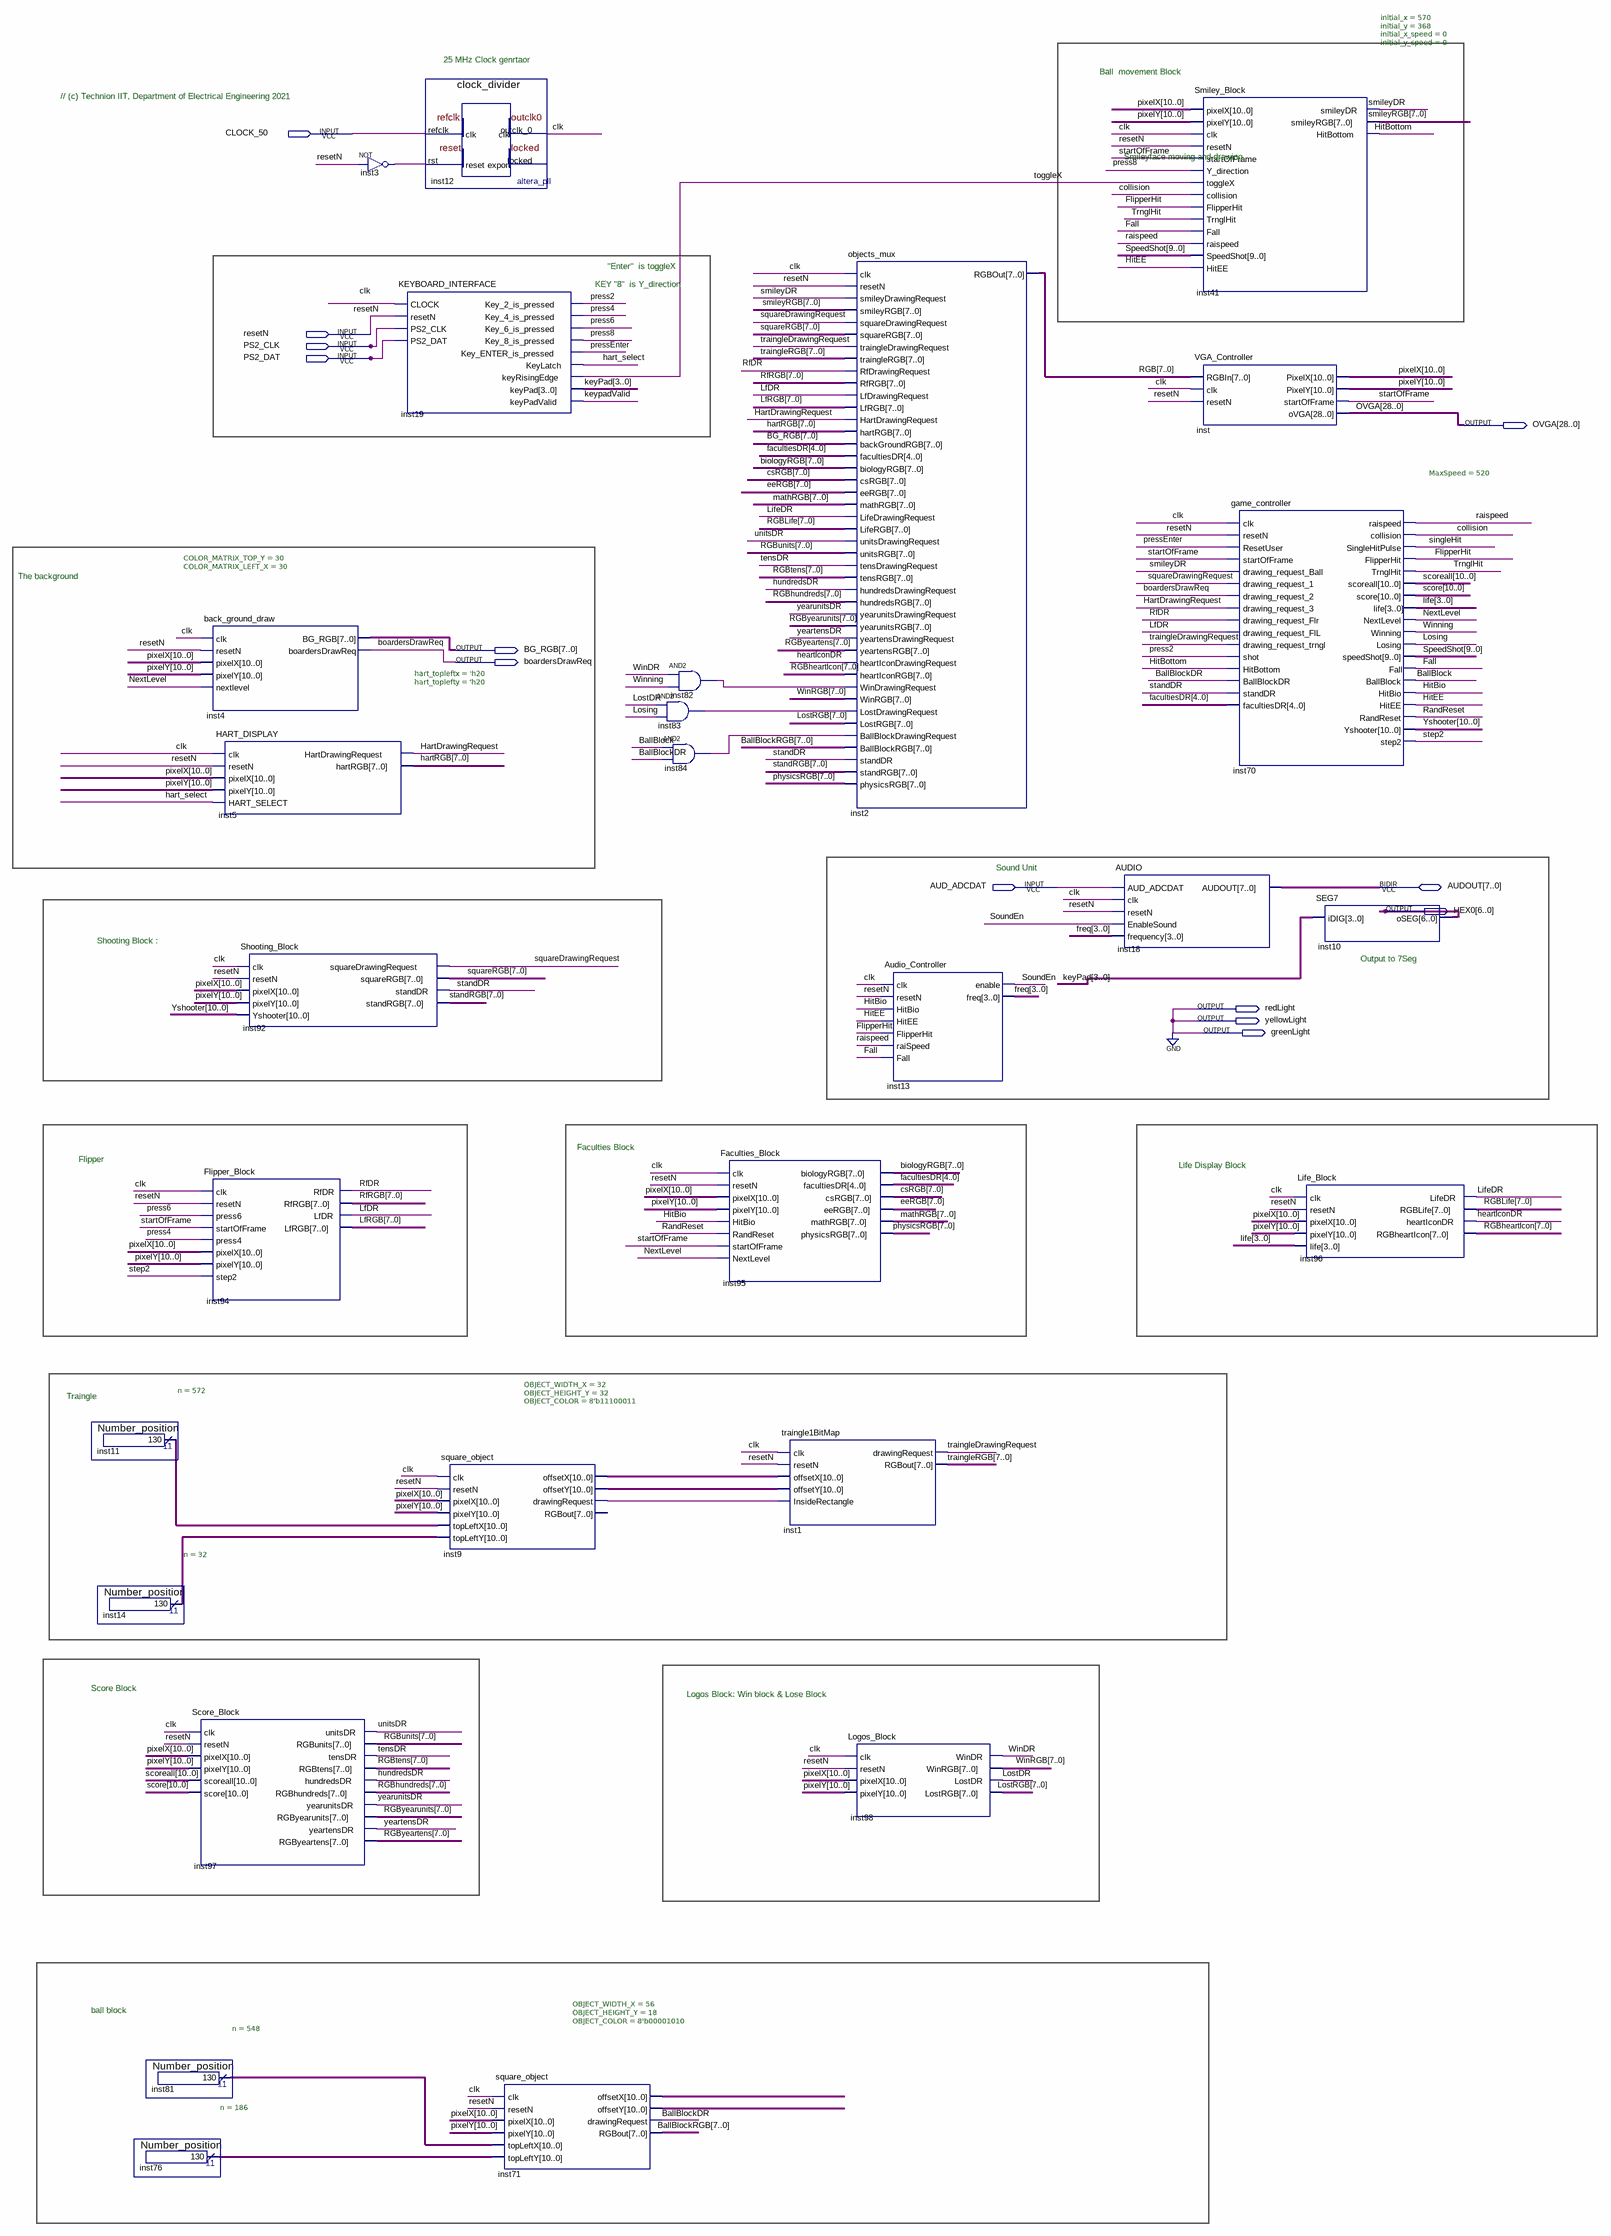
[diagram p0: schematic sheet]
// Quartus schematic Project_Top.bdf as structural Verilog: 28 symbols, 13 pins
module Project_Top (
  input  CLOCK_50,
  input  resetN,
  input  PS2_CLK,
  input  PS2_DAT,
  input  AUD_ADCDAT,
  inout  [7:0] AUDOUT,
  output [28:0] OVGA,
  output [7:0] BG_RGB,
  output boardersDrawReq,
  output [6:0] HEX0,
  output redLight,
  output yellowLight,
  output greenLight
);

  wire BallBlock, BallBlockDR, clk, collision, Fall, FlipperHit, hart_select, HartDrawingRequest,
       heartIconDR, HitBio, HitBottom, HitEE, hundredsDR, inst3_out, inst9_drawingrequest, inst82_out,
       inst83_out, inst84_out, keypadValid, LfDR, LifeDR, Losing, LostDR, NextLevel, press2, press4, press6,
       press8, pressEnter, raispeed, RandReset, RfDR, singleHit, smileyDR, SoundEn, squareDrawingRequest,
       standDR, startOfFrame, step2, tensDR, toggleX, traingleDrawingRequest, TrnglHit, unitsDR, WinDR,
       Winning, yeartensDR, yearunitsDR;
  wire [3:0] freq, keyPad, life;
  wire [4:0] facultiesDR;
  wire [7:0] BallBlockRGB, biologyRGB, csRGB, eeRGB, hartRGB, LfRGB, LostRGB, mathRGB, physicsRGB, RfRGB,
       RGB, RGBheartIcon, RGBhundreds, RGBLife, RGBtens, RGBunits, RGByeartens, RGByearunits, smileyRGB,
       squareRGB, standRGB, traingleRGB, WinRGB;
  wire [9:0] SpeedShot;
  wire [10:0] inst9_offsetx, inst9_offsety, inst11_result, inst14_result, inst71_offsetx, inst71_offsety,
       inst76_result, inst81_result, pixelX, pixelY, score, scoreall, Yshooter;

  Number_position #(.n(572)) inst11 (.result(inst11_result));
  Number_position #(.n(32)) inst14 (.result(inst14_result));
  Number_position #(.n(548)) inst81 (.result(inst81_result));
  Number_position #(.n(186)) inst76 (.result(inst76_result));
  Score_Block inst97 (
    .clk(clk), .resetN(resetN), .pixelX(pixelX), .pixelY(pixelY), .scoreall(scoreall), .score(score),
    .unitsDR(unitsDR), .RGBunits(RGBunits), .tensDR(tensDR), .RGBtens(RGBtens), .hundredsDR(hundredsDR),
    .RGBhundreds(RGBhundreds), .yearunitsDR(yearunitsDR), .RGByearunits(RGByearunits),
    .yeartensDR(yeartensDR), .RGByeartens(RGByeartens));
  back_ground_draw #(.COLOR_MATRIX_TOP_Y(30), .COLOR_MATRIX_LEFT_X(30)) inst4 (
    .clk(clk), .resetN(resetN), .pixelX(pixelX), .pixelY(pixelY), .nextlevel(NextLevel), .BG_RGB(BG_RGB),
    .boardersDrawReq(boardersDrawReq));
  HART_DISPLAY #(.hart_topleftx('h20), .hart_toplefty('h20)) inst5 (
    .clk(clk), .resetN(resetN), .pixelX(pixelX), .pixelY(pixelY), .HART_SELECT(hart_select),
    .HartDrawingRequest(HartDrawingRequest), .hartRGB(hartRGB));
  Shooting_Block inst92 (
    .clk(clk), .resetN(resetN), .pixelX(pixelX), .pixelY(pixelY), .Yshooter(Yshooter),
    .squareDrawingRequest(squareDrawingRequest), .squareRGB(squareRGB), .standDR(standDR), .standRGB(standRGB));
  Flipper_Block inst94 (
    .clk(clk), .resetN(resetN), .press6(press6), .startOfFrame(startOfFrame), .press4(press4),
    .pixelX(pixelX), .pixelY(pixelY), .step2(step2), .RfDR(RfDR), .RfRGB(RfRGB), .LfDR(LfDR), .LfRGB(LfRGB));
  not inst3 (inst3_out, resetN);
  clock_divider inst12 (.refclk(CLOCK_50), .rst(inst3_out), .outclk_0(clk));  // open: locked
  KEYBOARD_INTERFACE inst19 (
    .CLOCK(clk), .resetN(resetN), .PS2_CLK(PS2_CLK), .PS2_DAT(PS2_DAT), .Key_2_is_pressed(press2),
    .Key_4_is_pressed(press4), .Key_6_is_pressed(press6), .Key_8_is_pressed(press8),
    .Key_ENTER_is_pressed(pressEnter), .KeyLatch(hart_select), .keyRisingEdge(toggleX), .keyPad(keyPad),
    .keyPadValid(keypadValid));
  square_object #(.OBJECT_WIDTH_X(32), .OBJECT_HEIGHT_Y(32), .OBJECT_COLOR(8'b11100011)) inst9 (
    .clk(clk), .resetN(resetN), .pixelX(pixelX), .pixelY(pixelY), .topLeftX(inst11_result),
    .topLeftY(inst14_result), .offsetX(inst9_offsetx), .offsetY(inst9_offsety),
    .drawingRequest(inst9_drawingrequest));  // open: RGBout
  square_object #(.OBJECT_WIDTH_X(56), .OBJECT_HEIGHT_Y(18), .OBJECT_COLOR(8'b00001010)) inst71 (
    .clk(clk), .resetN(resetN), .pixelX(pixelX), .pixelY(pixelY), .topLeftX(inst81_result),
    .topLeftY(inst76_result), .offsetX(inst71_offsetx), .offsetY(inst71_offsety),
    .drawingRequest(BallBlockDR), .RGBout(BallBlockRGB));
  and inst82 (inst82_out, WinDR, Winning);
  and inst83 (inst83_out, LostDR, Losing);
  and inst84 (inst84_out, BallBlock, BallBlockDR);
  Faculties_Block inst95 (
    .clk(clk), .resetN(resetN), .pixelX(pixelX), .pixelY(pixelY), .HitBio(HitBio), .RandReset(RandReset),
    .startOfFrame(startOfFrame), .NextLevel(NextLevel), .biologyRGB(biologyRGB), .facultiesDR(facultiesDR),
    .csRGB(csRGB), .eeRGB(eeRGB), .mathRGB(mathRGB), .physicsRGB(physicsRGB));
  traingle1BitMap inst1 (
    .clk(clk), .resetN(resetN), .offsetX(inst9_offsetx), .offsetY(inst9_offsety),
    .InsideRectangle(inst9_drawingrequest), .drawingRequest(traingleDrawingRequest), .RGBout(traingleRGB));
  objects_mux inst2 (
    .clk(clk), .resetN(resetN), .smileyDrawingRequest(smileyDR), .smileyRGB(smileyRGB),
    .squareDrawingRequest(squareDrawingRequest), .squareRGB(squareRGB),
    .traingleDrawingRequest(traingleDrawingRequest), .traingleRGB(traingleRGB), .RfDrawingRequest(RfDR),
    .RfRGB(RfRGB), .LfDrawingRequest(LfDR), .LfRGB(LfRGB), .HartDrawingRequest(HartDrawingRequest),
    .hartRGB(hartRGB), .backGroundRGB(BG_RGB), .facultiesDR(facultiesDR), .biologyRGB(biologyRGB),
    .csRGB(csRGB), .eeRGB(eeRGB), .mathRGB(mathRGB), .LifeDrawingRequest(LifeDR), .LifeRGB(RGBLife),
    .unitsDrawingRequest(unitsDR), .unitsRGB(RGBunits), .tensDrawingRequest(tensDR), .tensRGB(RGBtens),
    .hundredsDrawingRequest(hundredsDR), .hundredsRGB(RGBhundreds), .yearunitsDrawingRequest(yearunitsDR),
    .yearunitsRGB(RGByearunits), .yeartensDrawingRequest(yeartensDR), .yeartensRGB(RGByeartens),
    .heartIconDrawingRequest(heartIconDR), .heartIconRGB(RGBheartIcon), .WinDrawingRequest(inst82_out),
    .WinRGB(WinRGB), .LostDrawingRequest(inst83_out), .LostRGB(LostRGB),
    .BallBlockDrawingRequest(inst84_out), .BallBlockRGB(BallBlockRGB), .standDR(standDR),
    .standRGB(standRGB), .physicsRGB(physicsRGB), .RGBOut(RGB));
  Logos_Block inst98 (
    .clk(clk), .resetN(resetN), .pixelX(pixelX), .pixelY(pixelY), .WinDR(WinDR), .WinRGB(WinRGB),
    .LostDR(LostDR), .LostRGB(LostRGB));
  Audio_Controller inst13 (
    .clk(clk), .resetN(resetN), .HitBio(HitBio), .HitEE(HitEE), .FlipperHit(FlipperHit), .raiSpeed(raispeed),
    .Fall(Fall), .enable(SoundEn), .freq(freq));
  AUDIO inst18 (
    .AUD_ADCDAT(AUD_ADCDAT), .clk(clk), .resetN(resetN), .EnableSound(SoundEn), .frequency(freq),
    .AUDOUT(AUDOUT));
  Smiley_Block #(.initial_x(570), .initial_y(368), .initial_x_speed(0), .initial_y_speed(0)) inst41 (
    .pixelX(pixelX), .pixelY(pixelY), .clk(clk), .resetN(resetN), .startOfFrame(startOfFrame),
    .Y_direction(press8), .toggleX(toggleX), .collision(collision), .FlipperHit(FlipperHit),
    .TrnglHit(TrnglHit), .Fall(Fall), .raispeed(raispeed), .SpeedShot(SpeedShot), .HitEE(HitEE),
    .smileyDR(smileyDR), .smileyRGB(smileyRGB), .HitBottom(HitBottom));
  VGA_Controller inst (
    .RGBIn(RGB), .clk(clk), .resetN(resetN), .PixelX(pixelX), .PixelY(pixelY), .startOfFrame(startOfFrame),
    .oVGA(OVGA));
  game_controller #(.MaxSpeed(520)) inst70 (
    .clk(clk), .resetN(resetN), .ResetUser(pressEnter), .startOfFrame(startOfFrame),
    .drawing_request_Ball(smileyDR), .drawing_request_1(squareDrawingRequest),
    .drawing_request_2(boardersDrawReq), .drawing_request_3(HartDrawingRequest), .drawing_request_Flr(RfDR),
    .drawing_request_FlL(LfDR), .drawing_request_trngl(traingleDrawingRequest), .shot(press2),
    .HitBottom(HitBottom), .BallBlockDR(BallBlockDR), .standDR(standDR), .facultiesDR(facultiesDR),
    .raispeed(raispeed), .collision(collision), .SingleHitPulse(singleHit), .FlipperHit(FlipperHit),
    .TrnglHit(TrnglHit), .scoreall(scoreall), .score(score), .life(life), .NextLevel(NextLevel),
    .Winning(Winning), .Losing(Losing), .speedShot(SpeedShot), .Fall(Fall), .BallBlock(BallBlock),
    .HitBio(HitBio), .HitEE(HitEE), .RandReset(RandReset), .Yshooter(Yshooter), .step2(step2));
  SEG7 inst10 (.iDIG(keyPad), .oSEG(HEX0));
  Life_Block inst96 (
    .clk(clk), .resetN(resetN), .pixelX(pixelX), .pixelY(pixelY), .life(life), .LifeDR(LifeDR),
    .RGBLife(RGBLife), .heartIconDR(heartIconDR), .RGBheartIcon(RGBheartIcon));

  assign greenLight = 1'b0;
  assign redLight = 1'b0;
  assign yellowLight = 1'b0;

  // Notes on the sheet:
  //   25 MHz Clock genrtaor
  //   Ball  movement Block
  //   // (c) Technion IIT, Department of Electrical Engineering 2021
  //   Smileyface moving and drawing
  //   "Enter"  is toggleX
  //   KEY "8"  is Y_direction
  //   The background
  //   Sound Unit
  //   Shooting Block : 
  //   Output to 7Seg
  //   Faculties Block
  //   Flipper
  //   Life Display Block
  //   Traingle
  //   Score Block
  //   Logos Block: Win block & Lose Block   
  //   ball block
endmodule
